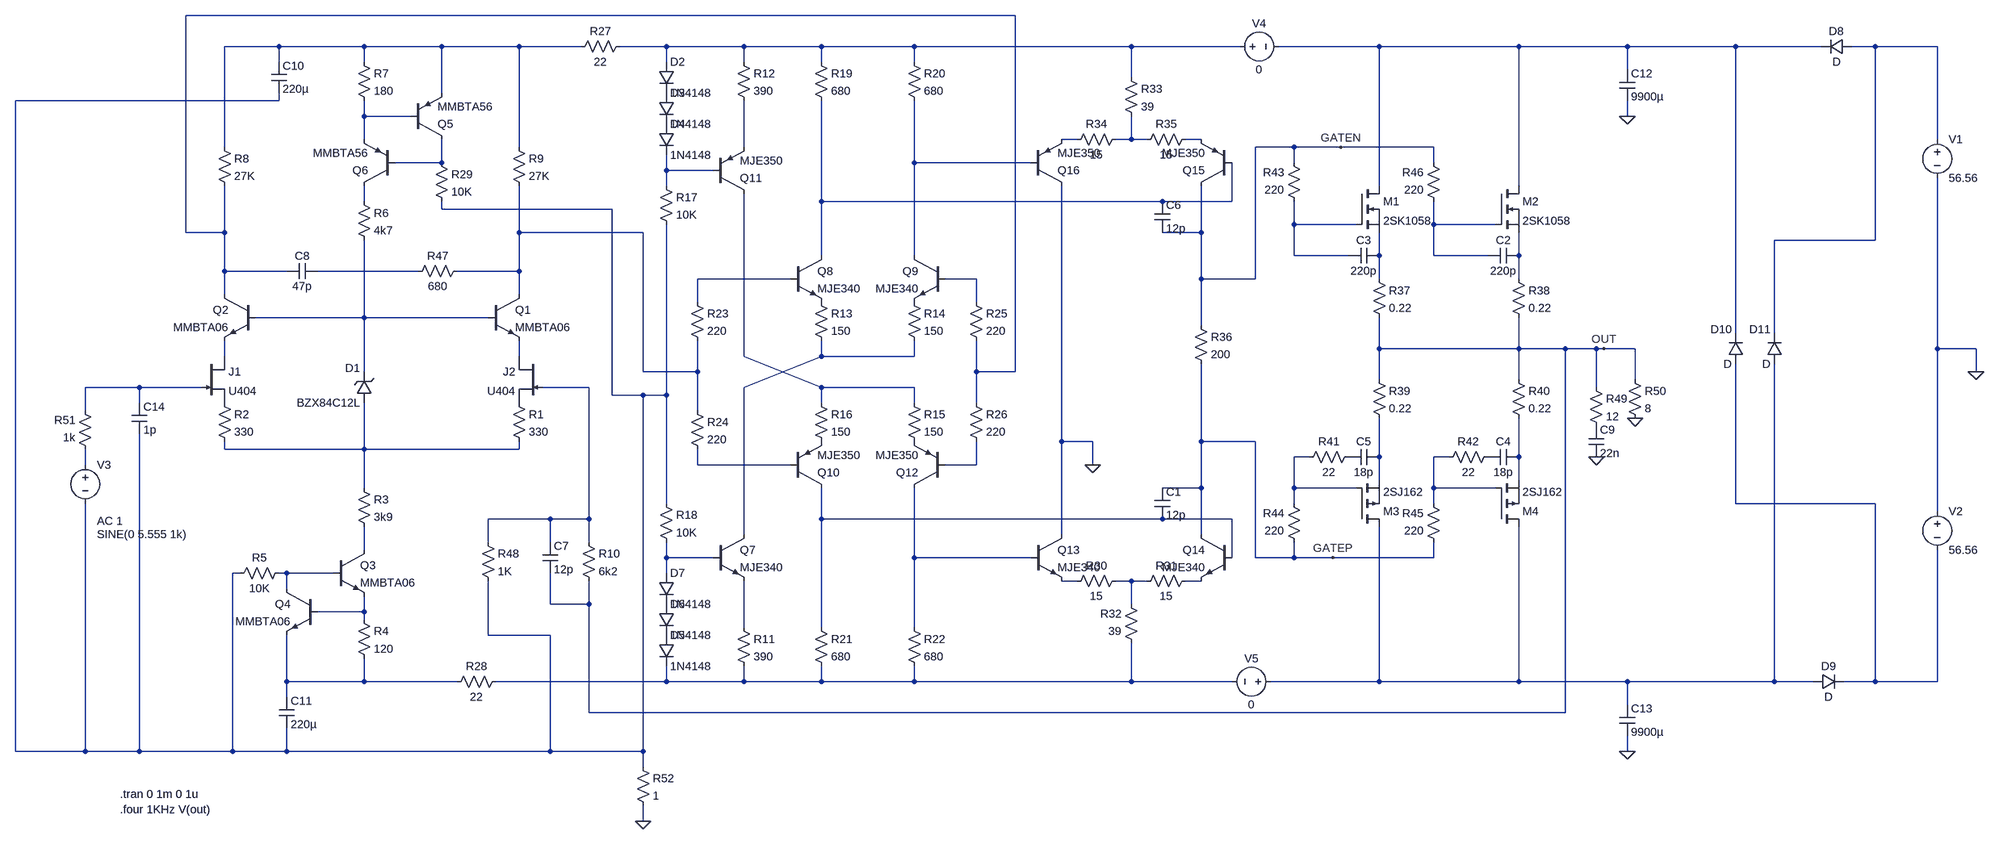
[diagram p0: schematic poweramp.asc]
poweramp.asc, the LTspice schematic file:
Version 4
SHEET 1 3816 1108
WIRE -432 944 -432 -400
WIRE -288 240 -288 192
WIRE -288 352 -288 320
WIRE -288 944 -432 944
WIRE -288 944 -288 432
WIRE -176 192 -288 192
WIRE -176 224 -176 192
WIRE -176 944 -288 944
WIRE -176 944 -176 288
WIRE -80 -128 -80 -576
WIRE -48 192 -176 192
WIRE 0 -304 0 -512
WIRE 0 -128 -80 -128
WIRE 0 -128 0 -224
WIRE 0 -48 0 -128
WIRE 0 0 0 -48
WIRE 0 128 0 96
WIRE 0 320 0 304
WIRE 16 944 -176 944
WIRE 16 944 16 576
WIRE 32 576 16 576
WIRE 112 -512 0 -512
WIRE 112 -480 112 -512
WIRE 112 -400 -432 -400
WIRE 112 -400 112 -416
WIRE 128 -48 0 -48
WIRE 128 576 112 576
WIRE 128 608 128 576
WIRE 128 800 128 704
WIRE 128 832 128 800
WIRE 128 944 16 944
WIRE 128 944 128 896
WIRE 224 576 128 576
WIRE 288 -512 112 -512
WIRE 288 -480 288 -512
WIRE 288 -368 288 -400
WIRE 288 -320 288 -368
WIRE 288 -192 288 -224
WIRE 288 48 64 48
WIRE 288 48 288 -112
WIRE 288 160 288 48
WIRE 288 320 0 320
WIRE 288 320 288 224
WIRE 288 400 288 320
WIRE 288 528 288 480
WIRE 288 656 192 656
WIRE 288 656 288 624
WIRE 288 672 288 656
WIRE 288 800 128 800
WIRE 288 800 288 752
WIRE 384 -368 288 -368
WIRE 400 -48 192 -48
WIRE 448 -512 288 -512
WIRE 448 -416 448 -512
WIRE 448 -272 352 -272
WIRE 448 -272 448 -320
WIRE 448 -176 448 -192
WIRE 480 800 288 800
WIRE 544 48 288 48
WIRE 544 512 544 464
WIRE 544 704 544 592
WIRE 608 -512 448 -512
WIRE 608 -304 608 -512
WIRE 608 -128 608 -224
WIRE 608 -48 480 -48
WIRE 608 -48 608 -128
WIRE 608 0 608 -48
WIRE 608 128 608 96
WIRE 608 320 288 320
WIRE 608 320 608 304
WIRE 672 464 544 464
WIRE 672 512 672 464
WIRE 672 640 672 576
WIRE 672 704 544 704
WIRE 672 944 128 944
WIRE 672 944 672 704
WIRE 736 -512 608 -512
WIRE 752 192 656 192
WIRE 752 464 672 464
WIRE 752 464 752 192
WIRE 752 512 752 464
WIRE 752 640 672 640
WIRE 752 640 752 592
WIRE 752 864 752 640
WIRE 800 -176 448 -176
WIRE 800 208 800 -176
WIRE 864 -128 608 -128
WIRE 864 160 864 -128
WIRE 864 208 800 208
WIRE 864 944 672 944
WIRE 864 944 864 208
WIRE 864 976 864 944
WIRE 864 1088 864 1056
WIRE 912 -512 816 -512
WIRE 912 -480 912 -512
WIRE 912 -256 912 -288
WIRE 912 -224 912 -256
WIRE 912 208 864 208
WIRE 912 208 912 -144
WIRE 912 432 912 208
WIRE 912 544 912 512
WIRE 912 576 912 544
WIRE 912 800 560 800
WIRE 912 800 912 768
WIRE 976 16 976 -32
WIRE 976 160 864 160
WIRE 976 160 976 96
WIRE 976 240 976 160
WIRE 976 352 976 320
WIRE 1008 -256 912 -256
WIRE 1008 544 912 544
WIRE 1072 -512 912 -512
WIRE 1072 -480 1072 -512
WIRE 1072 -304 1072 -400
WIRE 1072 128 1072 -208
WIRE 1072 496 1072 192
WIRE 1072 688 1072 592
WIRE 1072 800 912 800
WIRE 1072 800 1072 768
WIRE 1168 -32 976 -32
WIRE 1168 352 976 352
WIRE 1232 -512 1072 -512
WIRE 1232 -480 1232 -512
WIRE 1232 -192 1232 -400
WIRE 1232 -80 1232 -192
WIRE 1232 128 1072 192
WIRE 1232 128 1232 96
WIRE 1232 192 1072 128
WIRE 1232 224 1232 192
WIRE 1232 464 1232 400
WIRE 1232 688 1232 464
WIRE 1232 800 1072 800
WIRE 1232 800 1232 768
WIRE 1424 -512 1232 -512
WIRE 1424 -480 1424 -512
WIRE 1424 -272 1424 -400
WIRE 1424 -80 1424 -272
WIRE 1424 128 1232 128
WIRE 1424 128 1424 96
WIRE 1424 192 1232 192
WIRE 1424 224 1424 192
WIRE 1424 544 1424 400
WIRE 1424 688 1424 544
WIRE 1424 800 1232 800
WIRE 1424 800 1424 768
WIRE 1552 -32 1488 -32
WIRE 1552 16 1552 -32
WIRE 1552 160 1552 96
WIRE 1552 224 1552 160
WIRE 1552 352 1488 352
WIRE 1552 352 1552 304
WIRE 1632 -576 -80 -576
WIRE 1632 160 1552 160
WIRE 1632 160 1632 -576
WIRE 1664 -272 1424 -272
WIRE 1664 544 1424 544
WIRE 1728 304 1728 -224
WIRE 1728 496 1728 304
WIRE 1760 -320 1728 -320
WIRE 1760 592 1728 592
WIRE 1792 304 1728 304
WIRE 1792 352 1792 304
WIRE 1872 -512 1424 -512
WIRE 1872 -448 1872 -512
WIRE 1872 -320 1840 -320
WIRE 1872 -320 1872 -368
WIRE 1872 592 1840 592
WIRE 1872 640 1872 592
WIRE 1872 800 1424 800
WIRE 1872 800 1872 720
WIRE 1904 -320 1872 -320
WIRE 1904 592 1872 592
WIRE 1936 -192 1232 -192
WIRE 1936 464 1232 464
WIRE 2016 -320 1984 -320
WIRE 2016 -128 1936 -128
WIRE 2016 -128 2016 -224
WIRE 2016 -32 2016 -128
WIRE 2016 64 2016 -32
WIRE 2016 304 2016 144
WIRE 2016 400 1936 400
WIRE 2016 400 2016 304
WIRE 2016 496 2016 400
WIRE 2016 592 1984 592
WIRE 2080 -192 1936 -192
WIRE 2080 -192 2080 -272
WIRE 2080 464 1936 464
WIRE 2080 544 2080 464
WIRE 2080 800 1872 800
WIRE 2096 -512 1872 -512
WIRE 2128 -32 2016 -32
WIRE 2128 -32 2128 -304
WIRE 2128 304 2016 304
WIRE 2128 544 2128 304
WIRE 2208 -304 2128 -304
WIRE 2208 -272 2208 -304
WIRE 2208 -144 2208 -192
WIRE 2208 -80 2208 -144
WIRE 2208 400 2208 336
WIRE 2208 432 2208 400
WIRE 2208 544 2128 544
WIRE 2208 544 2208 512
WIRE 2240 336 2208 336
WIRE 2288 544 2208 544
WIRE 2304 -304 2208 -304
WIRE 2320 -80 2208 -80
WIRE 2336 -144 2208 -144
WIRE 2336 400 2208 400
WIRE 2384 -512 2176 -512
WIRE 2384 -224 2384 -512
WIRE 2384 -80 2384 -128
WIRE 2384 -32 2384 -80
WIRE 2384 112 2384 48
WIRE 2384 176 2384 112
WIRE 2384 336 2384 256
WIRE 2384 384 2384 336
WIRE 2384 800 2160 800
WIRE 2384 800 2384 480
WIRE 2496 -304 2304 -304
WIRE 2496 -272 2496 -304
WIRE 2496 -144 2496 -192
WIRE 2496 -80 2496 -144
WIRE 2496 400 2496 336
WIRE 2496 432 2496 400
WIRE 2496 544 2288 544
WIRE 2496 544 2496 512
WIRE 2528 336 2496 336
WIRE 2608 -80 2496 -80
WIRE 2624 -144 2496 -144
WIRE 2624 400 2496 400
WIRE 2672 -512 2384 -512
WIRE 2672 -224 2672 -512
WIRE 2672 -80 2672 -128
WIRE 2672 -32 2672 -80
WIRE 2672 112 2384 112
WIRE 2672 112 2672 48
WIRE 2672 176 2672 112
WIRE 2672 336 2672 256
WIRE 2672 384 2672 336
WIRE 2672 800 2384 800
WIRE 2672 800 2672 480
WIRE 2768 112 2672 112
WIRE 2768 864 752 864
WIRE 2768 864 2768 112
WIRE 2832 112 2768 112
WIRE 2832 192 2832 112
WIRE 2848 112 2832 112
WIRE 2896 -512 2672 -512
WIRE 2896 -464 2896 -512
WIRE 2896 -368 2896 -400
WIRE 2896 800 2672 800
WIRE 2896 848 2896 800
WIRE 2896 944 2896 912
WIRE 2912 112 2848 112
WIRE 2912 176 2912 112
WIRE 3120 -512 2896 -512
WIRE 3120 80 3120 -512
WIRE 3120 432 3120 144
WIRE 3200 80 3200 -112
WIRE 3200 800 2896 800
WIRE 3200 800 3200 144
WIRE 3280 800 3200 800
WIRE 3296 -512 3120 -512
WIRE 3408 -512 3360 -512
WIRE 3408 -112 3200 -112
WIRE 3408 -112 3408 -512
WIRE 3408 432 3120 432
WIRE 3408 800 3344 800
WIRE 3408 800 3408 432
WIRE 3536 -512 3408 -512
WIRE 3536 -320 3536 -512
WIRE 3536 112 3536 -240
WIRE 3536 448 3536 112
WIRE 3536 800 3408 800
WIRE 3536 800 3536 528
WIRE 3616 112 3536 112
WIRE 3616 160 3616 112
FLAG 2832 336 0
FLAG 2912 256 0
FLAG 3616 160 0
FLAG 2848 112 OUT
FLAG 2288 544 GATEP
FLAG 2304 -304 GATEN
FLAG 864 1088 0
FLAG 2896 944 0
FLAG 1792 352 0
FLAG 2896 -368 0
SYMBOL njf -48 128 R0
SYMATTR InstName J1
SYMATTR Value U404
SYMBOL njf 656 128 M0
SYMATTR InstName J2
SYMATTR Value U404
SYMBOL npn 544 0 R0
SYMATTR InstName Q1
SYMATTR Value MMBTA06
SYMBOL npn 64 0 M0
SYMATTR InstName Q2
SYMATTR Value MMBTA06
SYMBOL res 592 208 R0
SYMATTR InstName R1
SYMATTR Value 330
SYMBOL res -16 208 R0
SYMATTR InstName R2
SYMATTR Value 330
SYMBOL zener 304 224 R180
WINDOW 0 24 72 Left 0
WINDOW 3 24 0 Left 0
SYMATTR InstName D1
SYMATTR Value BZX84C12L
SYMBOL res 272 384 R0
SYMATTR InstName R3
SYMATTR Value 3k9
SYMBOL npn 224 528 R0
SYMATTR InstName Q3
SYMATTR Value MMBTA06
SYMBOL npn 192 608 M0
SYMATTR InstName Q4
SYMATTR Value MMBTA06
SYMBOL res 272 656 R0
SYMATTR InstName R4
SYMATTR Value 120
SYMBOL res 128 560 R90
WINDOW 0 0 56 VBottom 0
WINDOW 3 32 56 VTop 0
SYMATTR InstName R5
SYMATTR Value 10K
SYMBOL pnp 384 -320 M180
SYMATTR InstName Q5
SYMATTR Value MMBTA56
SYMBOL pnp 352 -224 R180
SYMATTR InstName Q6
SYMATTR Value MMBTA56
SYMBOL res 272 -208 R0
SYMATTR InstName R6
SYMATTR Value 4k7
SYMBOL res 272 -496 R0
SYMATTR InstName R7
SYMATTR Value 180
SYMBOL res -16 -320 R0
SYMATTR InstName R8
SYMATTR Value 27K
SYMBOL res 592 -320 R0
SYMATTR InstName R9
SYMATTR Value 27K
SYMBOL diode 896 -480 R0
SYMATTR InstName D2
SYMATTR Value 1N4148
SYMBOL diode 896 -416 R0
SYMATTR InstName D3
SYMATTR Value 1N4148
SYMBOL diode 896 -352 R0
SYMATTR InstName D4
SYMATTR Value 1N4148
SYMBOL diode 896 704 R0
SYMATTR InstName D5
SYMATTR Value 1N4148
SYMBOL diode 896 640 R0
SYMATTR InstName D6
SYMATTR Value 1N4148
SYMBOL diode 896 576 R0
SYMATTR InstName D7
SYMATTR Value 1N4148
SYMBOL npn 1008 496 R0
SYMATTR InstName Q7
SYMATTR Value MJE340
SYMBOL npn 1168 -80 R0
SYMATTR InstName Q8
SYMATTR Value MJE340
SYMBOL npn 1488 -80 M0
SYMATTR InstName Q9
SYMATTR Value MJE340
SYMBOL pnp 1168 400 M180
SYMATTR InstName Q10
SYMATTR Value MJE350
SYMBOL pnp 1008 -208 M180
SYMATTR InstName Q11
SYMATTR Value MJE350
SYMBOL pnp 1488 400 R180
SYMATTR InstName Q12
SYMATTR Value MJE350
SYMBOL res 1056 672 R0
SYMATTR InstName R11
SYMATTR Value 390
SYMBOL res 1056 -496 R0
SYMATTR InstName R12
SYMATTR Value 390
SYMBOL res 1216 0 R0
SYMATTR InstName R13
SYMATTR Value 150
SYMBOL res 1408 0 R0
SYMATTR InstName R14
SYMATTR Value 150
SYMBOL res 1408 208 R0
SYMATTR InstName R15
SYMATTR Value 150
SYMBOL res 1216 208 R0
SYMATTR InstName R16
SYMATTR Value 150
SYMBOL res 896 -240 R0
SYMATTR InstName R17
SYMATTR Value 10K
SYMBOL res 896 416 R0
SYMATTR InstName R18
SYMATTR Value 10K
SYMBOL res 1216 -496 R0
SYMATTR InstName R19
SYMATTR Value 680
SYMBOL res 1408 -496 R0
SYMATTR InstName R20
SYMATTR Value 680
SYMBOL res 1216 672 R0
SYMATTR InstName R21
SYMATTR Value 680
SYMBOL res 1408 672 R0
SYMATTR InstName R22
SYMATTR Value 680
SYMBOL res 960 0 R0
SYMATTR InstName R23
SYMATTR Value 220
SYMBOL res 960 224 R0
SYMATTR InstName R24
SYMATTR Value 220
SYMBOL res 1536 0 R0
SYMATTR InstName R25
SYMATTR Value 220
SYMBOL res 1536 208 R0
SYMATTR InstName R26
SYMATTR Value 220
SYMBOL res 832 -528 R90
WINDOW 0 0 56 VBottom 0
WINDOW 3 32 56 VTop 0
SYMATTR InstName R27
SYMATTR Value 22
SYMBOL res 576 784 R90
WINDOW 0 0 56 VBottom 0
WINDOW 3 32 56 VTop 0
SYMATTR InstName R28
SYMATTR Value 22
SYMBOL res 432 -288 R0
SYMATTR InstName R29
SYMATTR Value 10K
SYMBOL npn 1664 496 R0
SYMATTR InstName Q13
SYMATTR Value MJE340
SYMBOL npn 2080 496 M0
SYMATTR InstName Q14
SYMATTR Value MJE340
SYMBOL res 1856 576 R90
WINDOW 0 0 56 VBottom 0
WINDOW 3 32 56 VTop 0
SYMATTR InstName R30
SYMATTR Value 15
SYMBOL res 2000 576 R90
WINDOW 0 0 56 VBottom 0
WINDOW 3 32 56 VTop 0
SYMATTR InstName R31
SYMATTR Value 15
SYMBOL res 1888 736 R180
WINDOW 0 36 76 Left 0
WINDOW 3 36 40 Left 0
SYMATTR InstName R32
SYMATTR Value 39
SYMBOL res 1856 -464 R0
SYMATTR InstName R33
SYMATTR Value 39
SYMBOL res 1856 -336 R90
WINDOW 0 0 56 VBottom 0
WINDOW 3 32 56 VTop 0
SYMATTR InstName R34
SYMATTR Value 15
SYMBOL res 2000 -336 R90
WINDOW 0 0 56 VBottom 0
WINDOW 3 32 56 VTop 0
SYMATTR InstName R35
SYMATTR Value 15
SYMBOL pnp 2080 -224 R180
SYMATTR InstName Q15
SYMATTR Value MJE350
SYMBOL pnp 1664 -224 M180
SYMATTR InstName Q16
SYMATTR Value MJE350
SYMBOL res 2000 48 R0
SYMATTR InstName R36
SYMATTR Value 200
SYMBOL nmos 2336 -224 R0
SYMATTR InstName M1
SYMATTR Value 2SK1058
SYMBOL nmos 2624 -224 R0
SYMATTR InstName M2
SYMATTR Value 2SK1058
SYMBOL pmos 2336 480 M180
SYMATTR InstName M3
SYMATTR Value 2SJ162
SYMBOL pmos 2624 480 M180
SYMATTR InstName M4
SYMATTR Value 2SJ162
SYMBOL res 2368 -48 R0
SYMATTR InstName R37
SYMATTR Value 0.22
SYMBOL res 2656 -48 R0
SYMATTR InstName R38
SYMATTR Value 0.22
SYMBOL res 2368 160 R0
SYMATTR InstName R39
SYMATTR Value 0.22
SYMBOL res 2656 160 R0
SYMATTR InstName R40
SYMATTR Value 0.22
SYMBOL cap 2672 -96 R90
WINDOW 0 0 32 VBottom 0
WINDOW 3 32 32 VTop 0
SYMATTR InstName C2
SYMATTR Value 220p
SYMBOL cap 2384 -96 R90
WINDOW 0 0 32 VBottom 0
WINDOW 3 32 32 VTop 0
SYMATTR InstName C3
SYMATTR Value 220p
SYMBOL cap 2672 320 R90
WINDOW 0 0 32 VBottom 0
WINDOW 3 32 32 VTop 0
SYMATTR InstName C4
SYMATTR Value 18p
SYMBOL cap 2384 320 R90
WINDOW 0 0 32 VBottom 0
WINDOW 3 32 32 VTop 0
SYMATTR InstName C5
SYMATTR Value 18p
SYMBOL res 2336 320 R90
WINDOW 0 0 56 VBottom 0
WINDOW 3 32 56 VTop 0
SYMATTR InstName R41
SYMATTR Value 22
SYMBOL res 2624 320 R90
WINDOW 0 0 56 VBottom 0
WINDOW 3 32 56 VTop 0
SYMATTR InstName R42
SYMATTR Value 22
SYMBOL res 2224 -176 R180
WINDOW 0 36 76 Left 0
WINDOW 3 36 40 Left 0
SYMATTR InstName R43
SYMATTR Value 220
SYMBOL res 2224 528 R180
WINDOW 0 36 76 Left 0
WINDOW 3 36 40 Left 0
SYMATTR InstName R44
SYMATTR Value 220
SYMBOL res 2512 528 R180
WINDOW 0 36 76 Left 0
WINDOW 3 36 40 Left 0
SYMATTR InstName R45
SYMATTR Value 220
SYMBOL res 2512 -176 R180
WINDOW 0 36 76 Left 0
WINDOW 3 36 40 Left 0
SYMATTR InstName R46
SYMATTR Value 220
SYMBOL res 528 496 R0
SYMATTR InstName R48
SYMATTR Value 1K
SYMBOL res 2816 176 R0
SYMATTR InstName R49
SYMATTR Value 12
SYMBOL cap 2816 272 R0
SYMATTR InstName C9
SYMATTR Value 22n
SYMBOL res 2896 160 R0
SYMATTR InstName R50
SYMATTR Value 8
SYMBOL voltage -288 336 R0
WINDOW 3 24 160 Left 0
WINDOW 123 24 132 Left 0
WINDOW 39 0 0 Left 0
SYMATTR Value SINE(0 5.555 1k)
SYMATTR Value2 AC 1
SYMATTR InstName V3
SYMBOL cap 96 -480 R0
SYMATTR InstName C10
SYMATTR Value 220µ
SYMATTR SpiceLine V=100
SYMBOL cap 112 832 R0
SYMATTR InstName C11
SYMATTR Value 220µ
SYMATTR SpiceLine V=100
SYMBOL res 736 496 R0
SYMATTR InstName R10
SYMATTR Value 6k2
SYMBOL cap 1920 400 R0
SYMATTR InstName C1
SYMATTR Value 12p
SYMBOL cap 1920 -192 R0
SYMATTR InstName C6
SYMATTR Value 12p
SYMBOL cap 656 512 R0
SYMATTR InstName C7
SYMATTR Value 12p
SYMBOL cap 192 -64 R90
WINDOW 0 0 32 VBottom 0
WINDOW 3 32 32 VTop 0
SYMATTR InstName C8
SYMATTR Value 47p
SYMBOL res 496 -64 R90
WINDOW 0 0 56 VBottom 0
WINDOW 3 32 56 VTop 0
SYMATTR InstName R47
SYMATTR Value 680
SYMBOL res -272 336 R180
WINDOW 0 36 76 Left 0
WINDOW 3 36 40 Left 0
SYMATTR InstName R51
SYMATTR Value 1k
SYMBOL voltage 2080 -512 R270
WINDOW 0 32 56 VTop 0
WINDOW 3 -32 56 VBottom 0
WINDOW 123 0 0 Left 0
WINDOW 39 0 0 Left 0
SYMATTR InstName V4
SYMATTR Value 0
SYMBOL voltage 2176 800 R90
WINDOW 0 -32 56 VBottom 0
WINDOW 3 32 56 VTop 0
WINDOW 123 0 0 Left 0
WINDOW 39 0 0 Left 0
SYMATTR InstName V5
SYMATTR Value 0
SYMBOL voltage 3536 -336 R0
WINDOW 123 24 44 Left 0
WINDOW 39 0 0 Left 0
SYMATTR InstName V1
SYMATTR Value 56.56
SYMBOL voltage 3536 432 R0
WINDOW 123 24 132 Left 0
WINDOW 39 0 0 Left 0
SYMATTR InstName V2
SYMATTR Value 56.56
SYMBOL diode 3360 -528 R90
WINDOW 0 0 32 VBottom 0
WINDOW 3 32 32 VTop 0
SYMATTR InstName D8
SYMBOL diode 3280 816 R270
WINDOW 0 32 32 VTop 0
WINDOW 3 0 32 VBottom 0
SYMATTR InstName D9
SYMBOL diode 3136 144 R180
WINDOW 0 24 72 Left 0
WINDOW 3 24 0 Left 0
SYMATTR InstName D10
SYMBOL diode 3216 144 R180
WINDOW 0 24 72 Left 0
WINDOW 3 24 0 Left 0
SYMATTR InstName D11
SYMBOL cap 2880 -464 R0
SYMATTR InstName C12
SYMATTR Value 9900µ
SYMATTR SpiceLine V=80 Rser=0.022
SYMBOL cap 2880 848 R0
SYMATTR InstName C13
SYMATTR Value 9900µ
SYMATTR SpiceLine V=80 Rser=0.022
SYMBOL cap -192 224 R0
SYMATTR InstName C14
SYMATTR Value 1p
SYMBOL res 848 960 R0
SYMATTR InstName R52
SYMATTR Value 1
TEXT -216 1032 Left 0 !.tran 0 1m 0 1u
TEXT -216 1064 Left 0 !.four 1KHz V(out)

The netlist it stands for:
* poweramp.asc
J1 N006 N002 P001 U404
J2 N019 N017 P002 U404
Q1 N018 N012 N019 0 MMBTA06
Q2 N004 N012 N006 0 MMBTA06
R1 P002 N007 330
R2 P001 N007 330
D1 N007 N012 BZX84C12L
R3 N007 N013 3k9
Q3 N013 N008 N014 0 MMBTA06
Q4 N008 N014 N009 0 MMBTA06
R4 N014 N009 120
R5 N008 N001 10K
Q5 N016 N010 N005 0 MMBTA56
Q6 N011 N016 N010 0 MMBTA56
R6 N011 N012 4k7
R7 N005 N010 180
R8 N005 N004 27K
R9 N005 N018 27K
D2 N020 P003 1N4148
D3 P003 P004 1N4148
D4 P004 N021 1N4148
D5 P005 N023 1N4148
D6 P006 P005 1N4148
D7 N022 P006 1N4148
Q7 N028 N022 N029 0 MJE340
Q8 N030 N024 P007 0 MJE340
Q9 N032 N034 P008 0 MJE340
Q10 N031 N025 P009 0 MJE350
Q11 N027 N021 N026 0 MJE350
Q12 N033 N035 P010 0 MJE350
R11 N029 N023 390
R12 N020 N026 390
R13 P007 N028 150
R14 P008 N028 150
R15 N027 P010 150
R16 N027 P009 150
R17 N021 N001 10K
R18 N001 N022 10K
R19 N020 N030 680
R20 N020 N032 680
R21 N031 N023 680
R22 N033 N023 680
R23 N024 N018 220
R24 N018 N025 220
R25 N034 N004 220
R26 N004 N035 220
R27 N020 N005 22
R28 N023 N009 22
R29 N016 N001 10K
Q13 0 N033 N037 0 MJE340
Q14 GATEP N031 N041 0 MJE340
R30 N039 N037 15
R31 N041 N039 15
R32 N023 N039 39
R33 N020 N038 39
R34 N038 N036 15
R35 N040 N038 15
Q15 GATEN N030 N040 0 MJE350
Q16 0 N032 N036 0 MJE350
R36 GATEN GATEP 200
M1 N044 N042 N045 N045 2SK1058
M2 N044 N048 N050 N050 2SK1058
M3 N047 N043 N046 N046 2SJ162
M4 N047 N049 N051 N051 2SJ162
R37 N045 OUT 0.22
R38 N050 OUT 0.22
R39 OUT N046 0.22
R40 OUT N051 0.22
C2 N050 N048 220p
C3 N045 N042 220p
C4 N051 P011 18p
C5 N046 P012 18p
R41 P012 N043 22
R42 P011 N049 22
R43 N042 GATEN 220
R44 GATEP N043 220
R45 GATEP N049 220
R46 N048 GATEN 220
R48 N017 N001 1K
R49 OUT P013 12
C9 P013 0 22n
R50 OUT 0 8
V3 N003 N001 SINE(0 5.555 1k) AC 1
C10 N005 N001 220µ V=100
C11 N009 N001 220µ V=100
R10 N017 OUT 6k2
C1 GATEP N031 12p
C6 N030 GATEN 12p
C7 N017 OUT 12p
C8 N015 N004 47p
R47 N018 N015 680
R51 N003 N002 1k
V4 N020 N044 0
V5 N047 N023 0
V1 N053 0 56.56
V2 0 N052 56.56
D8 N053 N044 D
D9 N047 N052 D
D10 N052 N044 D
D11 N047 N053 D
C12 N044 0 9900µ V=80 Rser=0.022
C13 N047 0 9900µ V=80 Rser=0.022
C14 N002 N001 1p
R52 N001 0 1
.model D D
.lib standard.dio
.model NPN NPN
.model PNP PNP
.lib standard.bjt
.model NJF NJF
.model PJF PJF
.lib standard.jft
.model NMOS NMOS
.model PMOS PMOS
.lib standard.mos
.tran 0 1m 0 1u
.four 1KHz V(out)
.backanno
.end